# EAGLE schematic glove3 (EAGLE 9.2.0)
COMPANY: ADAFRUIT INDUSTRIES; DRAWN: KTOWN; REV: B
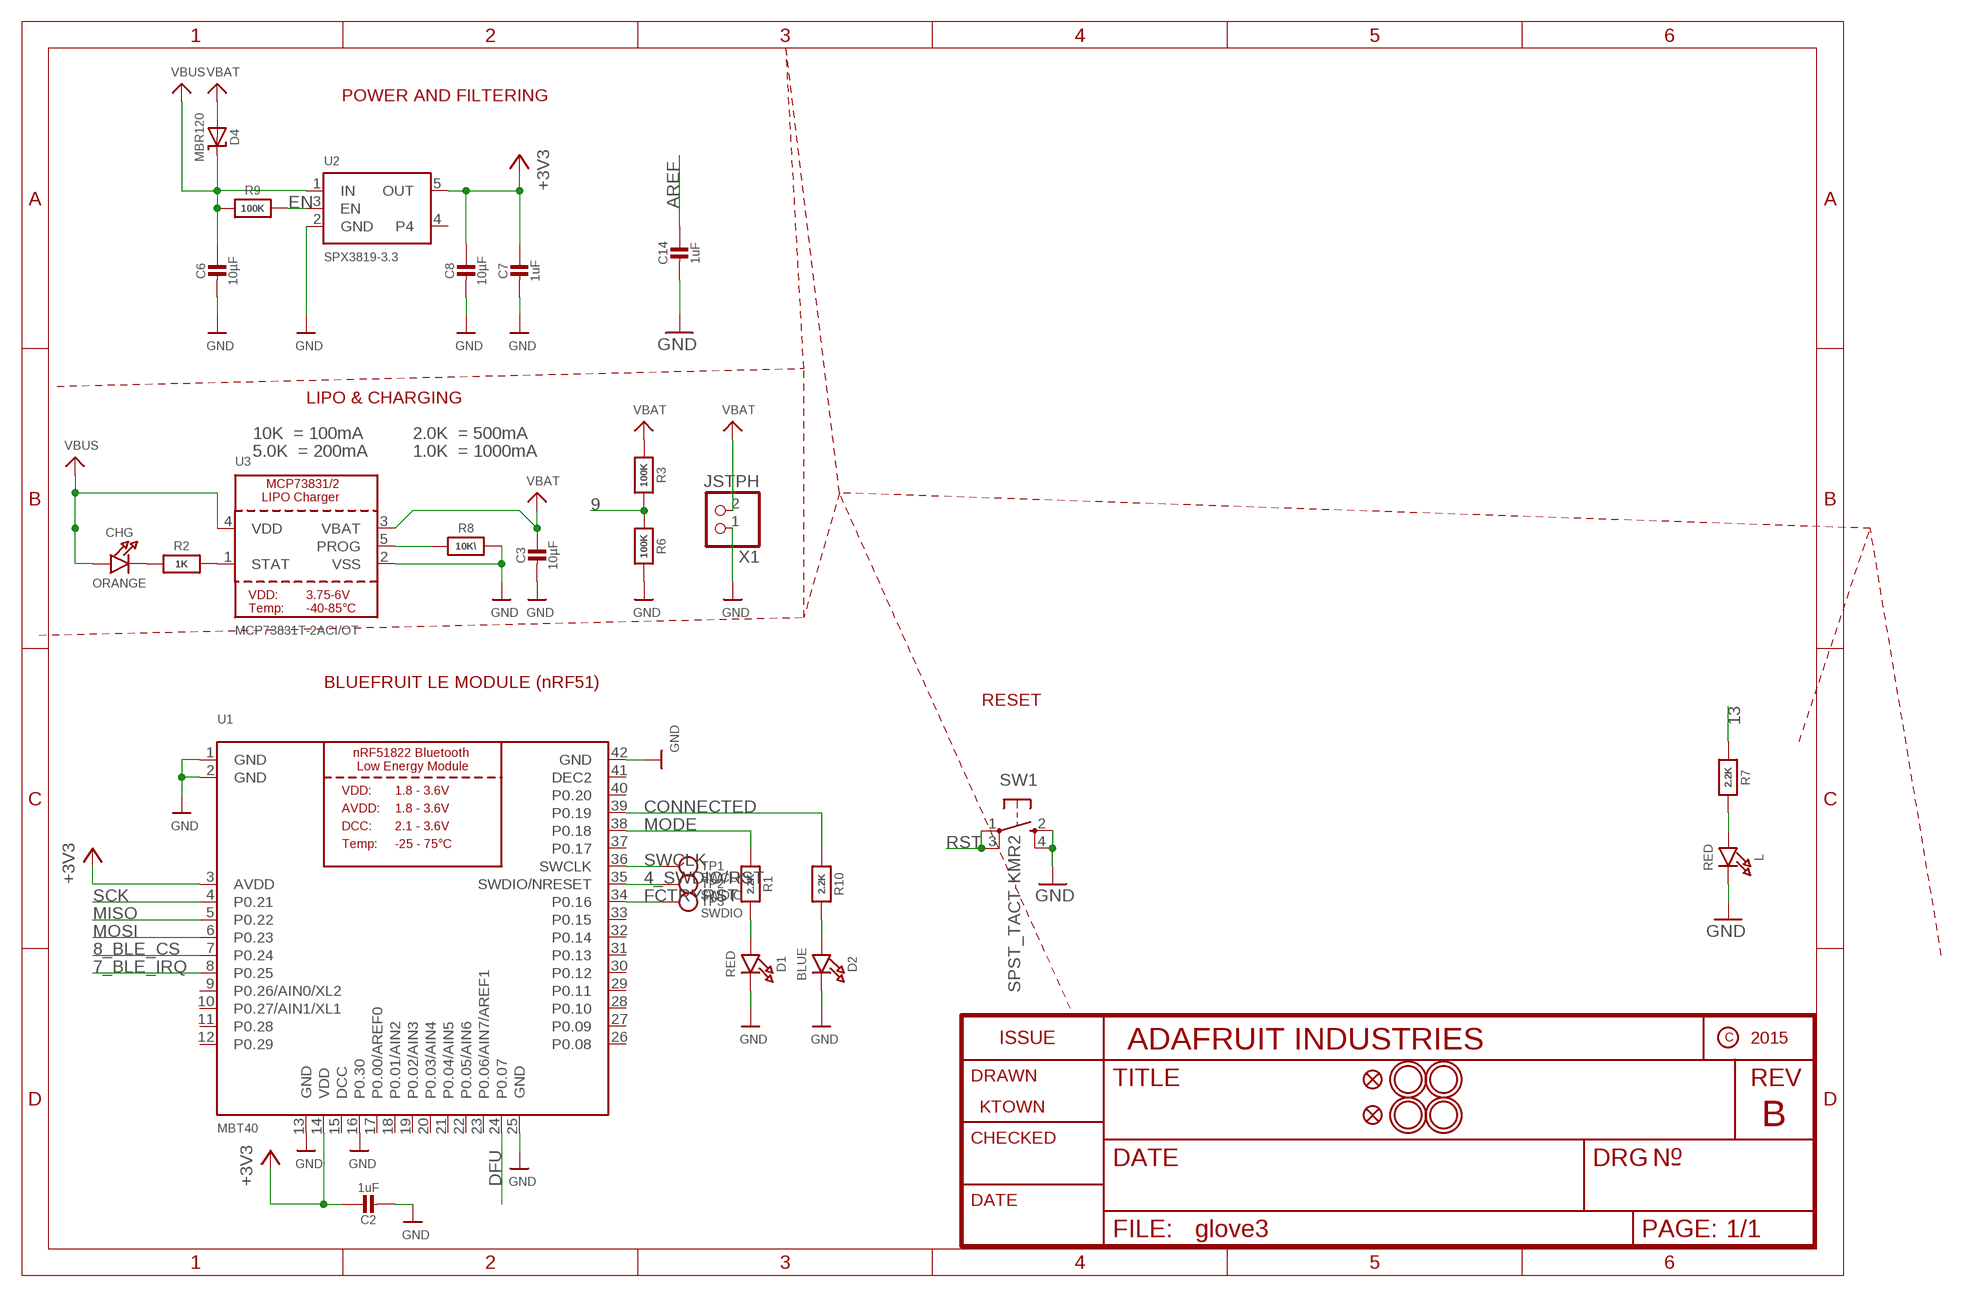
[diagram p0: schematic, sheet 1, part 1 of 2]
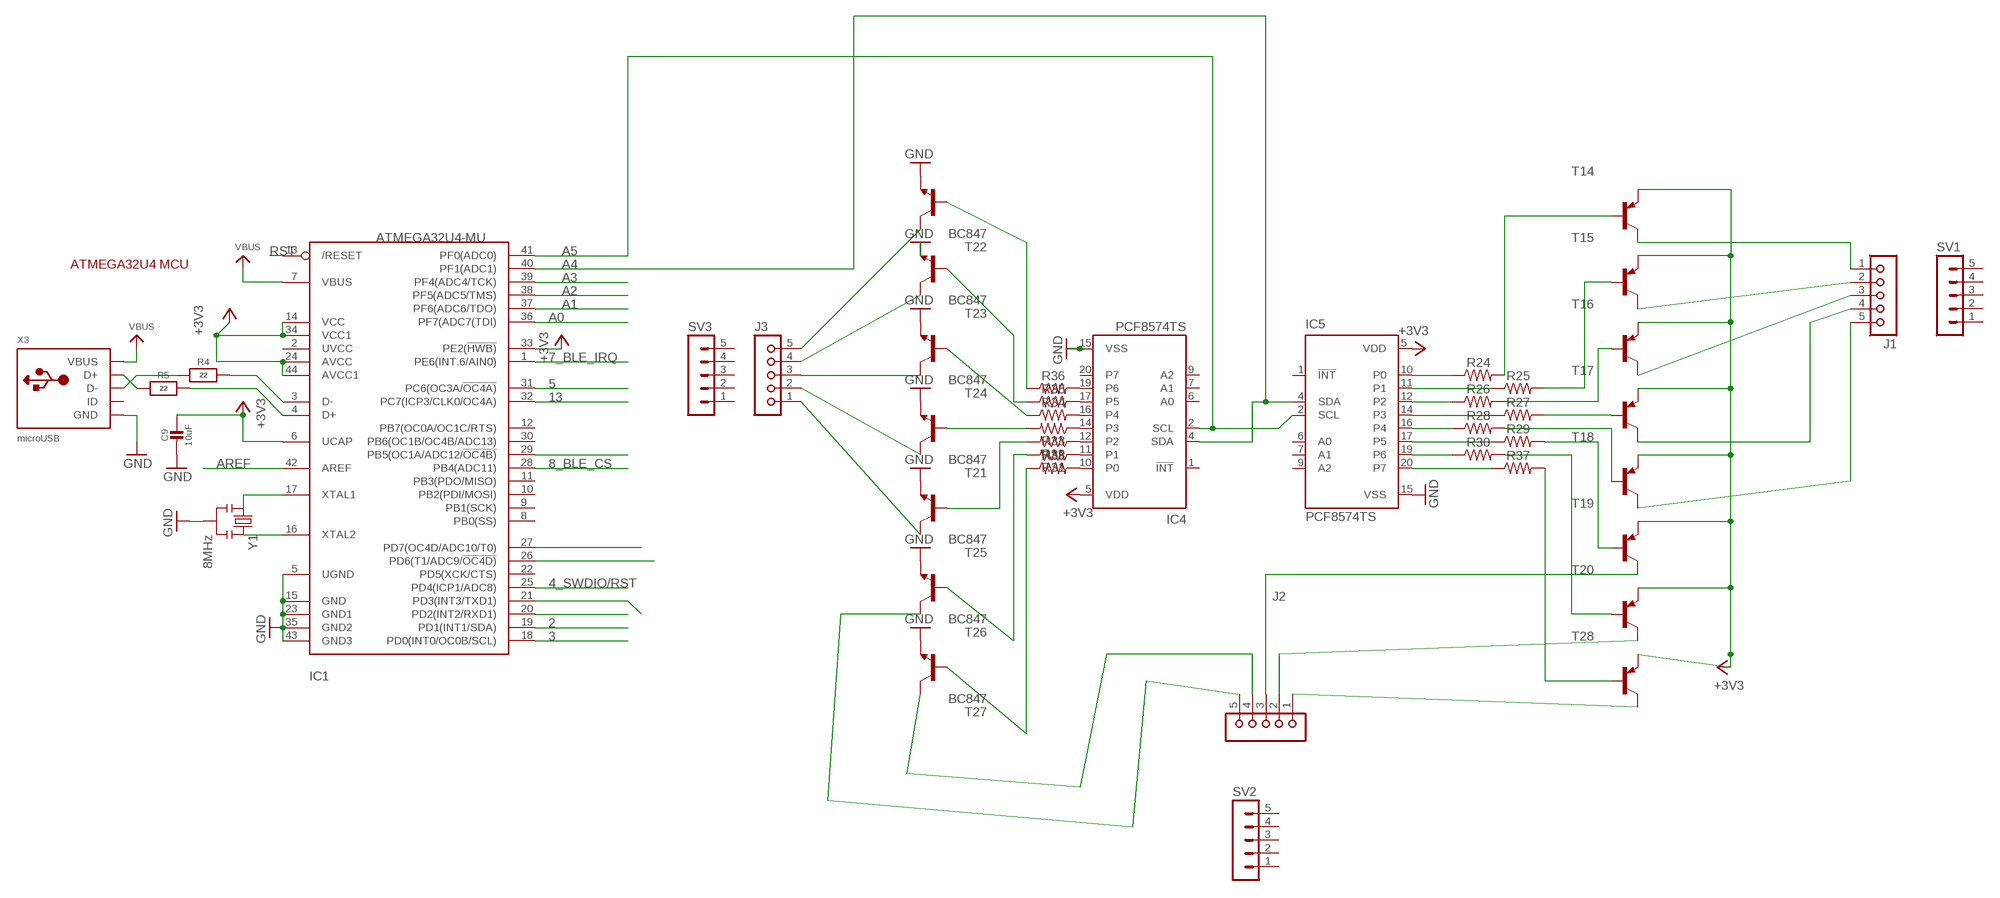
[diagram p1: schematic, sheet 1, part 2 of 2]

## Parts
C2  1uF  CAP_CERAMIC0603_NO  [0603-NO]
C3  10µF  CAP_CERAMIC0805-NOOUTLINE  [0805-NO]
C6  10µF  CAP_CERAMIC0805-NOOUTLINE  [0805-NO]
C7  1uF  CAP_CERAMIC0603_NO  [0603-NO]
C8  10µF  CAP_CERAMIC0805-NOOUTLINE  [0805-NO]
C9  10uF  CAP_CERAMIC_0805MP  [_0805MP]
C14  1uF  CAP_CERAMIC0603_NO  [0603-NO]
CHG  ORANGE  LED0805_NOOUTLINE  [CHIPLED_0805_NOOUTLINE]
D1  RED  LED0805_NOOUTLINE  [CHIPLED_0805_NOOUTLINE]
D2  BLUE  LED0805_NOOUTLINE  [CHIPLED_0805_NOOUTLINE]
D4  MBR120  DIODE-SCHOTTKYSOD-123  [SOD-123]
IC1  ATMEGA32U4-MU  [TQFN44_7MM]
IC4  PCF8574TS  [SSOP20]
IC5  PCF8574TS  [SSOP20]
J1  JU05  [JU05]
J2  JU05  [JU05]
J3  JU05  [JU05]
L  RED  LED0805_NOOUTLINE  [CHIPLED_0805_NOOUTLINE]
R1  2.2K  RESISTOR_0603_NOOUT  [0603-NO]
R2  1K  RESISTOR_0603_NOOUT  [0603-NO]
R3  100K  RESISTOR_0603_NOOUT  [0603-NO]
R4  22  RESISTOR_0603_NOOUT  [0603-NO]
R5  22  RESISTOR_0603_NOOUT  [0603-NO]
R6  100K  RESISTOR_0603_NOOUT  [0603-NO]
R7  2.2K  RESISTOR_0603_NOOUT  [0603-NO]
R8  10K\  RESISTOR_0603_NOOUT  [0603-NO]
R9  100K  RESISTOR_0603_NOOUT  [0603-NO]
R10  2.2K  RESISTOR_0603_NOOUT  [0603-NO]
R24  RESISTOR1206  [1206]
R25  RESISTOR1206  [1206]
R26  RESISTOR1206  [1206]
R27  RESISTOR1206  [1206]
R28  RESISTOR1206  [1206]
R29  RESISTOR1206  [1206]
R30  RESISTOR1206  [1206]
R31  RESISTOR1206  [1206]
R32  RESISTOR1206  [1206]
R33  RESISTOR1206  [1206]
R34  RESISTOR1206  [1206]
R35  RESISTOR1206  [1206]
R36  RESISTOR1206  [1206]
R37  RESISTOR1206  [1206]
R38  RESISTOR1206  [1206]
SV1  MA05-1  [MA05-1]
SV2  MA05-1  [MA05-1]
SV3  MA05-1  [MA05-1]
SW1  SPST_TACT-KMR2  [KMR2]
T14  BC857C-PNP-SOT23-BEC  [SOT23-BEC]
T15  BC857C-PNP-SOT23-BEC  [SOT23-BEC]
T16  BC857C-PNP-SOT23-BEC  [SOT23-BEC]
T17  BC857C-PNP-SOT23-BEC  [SOT23-BEC]
T18  BC857C-PNP-SOT23-BEC  [SOT23-BEC]
T19  BC857C-PNP-SOT23-BEC  [SOT23-BEC]
T20  BC857C-PNP-SOT23-BEC  [SOT23-BEC]
T21  BC847  [SOT23]
T22  BC847  [SOT23]
T23  BC847  [SOT23]
T24  BC847  [SOT23]
T25  BC847  [SOT23]
T26  BC847  [SOT23]
T27  BC847  [SOT23]
T28  BC857C-PNP-SOT23-BEC  [SOT23-BEC]
TP1  SWCLK  TESTPOINT1.5X2.0MM_NOCREAM  [PAD-1.5X2.0]
TP2  SWDIO  TESTPOINT1.5X2.0MM_NOCREAM  [PAD-1.5X2.0]
TP3  SWDIO  TESTPOINT1.5X2.0MM_NOCREAM  [PAD-1.5X2.0]
U1  MBT40  NRF51822_MODULE_MDBT40  [BLE_MODULE_RAYTAC_MDBT40]
U2  SPX3819-3.3  VREG_SOT23-5  [SOT23-5]
U3  MCP73831T-2ACI/OT  MCP73831/2  [SOT23-5]
U$6  MOUNTINGHOLE2.5  [MOUNTINGHOLE_2.5_PLATED]
U$24  MOUNTINGHOLE2.5  [MOUNTINGHOLE_2.5_PLATED]
U$31  MOUNTINGHOLE2.5  [MOUNTINGHOLE_2.5_PLATED]
U$32  MOUNTINGHOLE2.5  [MOUNTINGHOLE_2.5_PLATED]
U$34  FIDUCIAL""  [FIDUCIAL_1MM]
U$35  FIDUCIAL""  [FIDUCIAL_1MM]
X1  JSTPH  CON_JST_PH_2PIN  [JSTPH2]
X3  microUSB  USB_MICRO_20329_V2  [4UCONN_20329_V2]
Y1  8MHz  RESONATORSMD  [RESONATOR-SMD]

## Nets
2: IC1.19(PD1(INT1/SDA))
3: IC1.18(PD0(INT0/OC0B/SCL))
4_SWDIO/RST: IC1.25(PD4(ICP1/ADC8)) TP2.P$1 U1.35(SWDIO/NRESET)
5: IC1.31(PC6(OC3A/!OC4A))
7_BLE_IRQ: IC1.1(PE6(INT.6/AIN0)) U1.8(P0.25)
8_BLE_CS: IC1.28(PB4(ADC11)) U1.7(P0.24)
9: R3.2 R6.1
13: IC1.32(PC7(ICP3/CLK0/OC4A)) R7.1
+3V3: C2.1 C7.1 C8.1 C9.1 IC1.6(UCAP) IC1.14(VCC) IC1.24(AVCC) IC1.33(PE2(!HWB)) IC1.34(VCC1) IC1.44(AVCC1) IC4.5(VDD) IC5.5(VDD) T14.E T15.E T16.E T17.E T18.E T19.E T20.E T28.E U1.3(AVDD) U1.14(VDD) U2.5(OUT)
A0: IC1.36(PF7(ADC7(TDI))
A1: IC1.37(PF6(ADC6/TDO))
A2: IC1.38(PF5(ADC5/TMS))
A3: IC1.39(PF4(ADC4/TCK))
A4: IC1.40(PF1(ADC1)) IC4.4(SDA) IC5.4(SDA)
A5: IC1.41(PF0(ADC0)) IC4.2(SCL) IC5.2(SCL)
AREF: C14.1 IC1.42(AREF)
CONNECTED: R10.1 U1.39(P0.19)
D+: IC1.4(D+) R5.2
D-: IC1.3(D-) R4.2
DFU: U1.24(P0.07)
EN: R9.2 U2.3(EN)
FCTRYRST: TP3.P$1 U1.34(P0.16)
GND: C2.2 C3.2 C6.2 C7.2 C8.2 C9.2 C14.2 D1.C D2.C IC1.5(UGND) IC1.15(GND) IC1.23(GND1) IC1.35(GND2) IC1.43(GND3) IC4.15(VSS) IC5.15(VSS) L.C R6.2 R8.2 SW1.2(S) SW1.4(S1) T21.2(E) T22.2(E) T23.2(E) T24.2(E) T25.2(E) T26.2(E) T27.2(E) U1.1(GND) U1.2(GND) U1.13(GND) U1.16(P0.30) U1.25(GND) U1.42(GND) U2.2(GND) U3.2(VSS) X1.1 X3.BASE@1(GND) X3.BASE@2(GND) X3.GND X3.SPRT@1(GND) X3.SPRT@2(GND) X3.SPRT@3(GND) X3.SPRT@4(GND) Y1.2
MISO: U1.5(P0.22)
MODE: R1.1 U1.38(P0.18)
MOSI: U1.6(P0.23)
N$1: CHG.C R2.1
N$2: L.A R7.2
N$3: R2.2 U3.1(STAT)
N$4: R8.1 U3.5(PROG)
N$5: D1.A R1.2
N$6: D2.A R10.2
N$7: J1.1 T14.C
N$8: J1.2 T15.C
N$9: J1.3 T16.C
N$10: J1.4 T17.C
N$11: IC1.16(XTAL2) Y1.3
N$12: IC1.17(XTAL1) Y1.1
N$13: J1.5 T18.C
N$14: J3.5 T22.3(C)
N$15: R5.1 X3.D+
N$16: R4.1 X3.D-
N$17: IC1.20(PD2(INT2/RXD1))
N$18: IC1.21(PD3(INT3/TXD1))
N$19: J3.4 T23.3(C)
N$20: IC1.26(PD6(T1/ADC9/!OC4D))
N$21: IC1.27(PD7(OC4D/ADC10/T0))
N$22: IC1.29(PB5(OC1A/ADC12/!OC4B))
N$23: J3.3 T24.3(C)
N$24: J3.2 T21.3(C)
N$25: J3.1 T25.3(C)
N$26: J2.5 T26.3(C)
N$27: J2.4 T27.3(C)
N$28: J2.2 T20.C
N$29: J2.3 T19.C
N$30: J2.1 T28.C
N$38: IC5.10(P0) R24.1
N$39: IC5.11(P1) R25.1
N$46: IC5.12(P2) R26.1
N$48: IC5.14(P3) R27.1
N$49: IC5.16(P4) R28.1
N$50: IC5.17(P5) R29.1
N$51: IC5.19(P6) R30.1
N$52: R24.2 T14.B
N$53: R25.2 T15.B
N$54: R26.2 T16.B
N$55: R27.2 T17.B
N$56: R28.2 T18.B
N$57: R29.2 T19.B
N$58: R30.2 T20.B
N$59: IC4.10(P0) R38.2
N$60: R36.1 T22.1(B)
N$61: R35.1 T23.1(B)
N$62: R34.1 T24.1(B)
N$63: R33.2 T21.1(B)
N$64: R32.2 T25.1(B)
N$65: R31.2 T26.1(B)
N$66: IC4.11(P1) R31.1
N$67: IC4.12(P2) R32.1
N$68: IC4.14(P3) R33.1
N$69: IC4.16(P4) R34.2
N$70: IC4.17(P5) R35.2
N$71: IC4.19(P6) R36.2
N$72: IC5.20(P7) R37.1
N$73: R38.1 T27.1(B)
N$74: R37.2 T28.B
RST: IC1.13(/RESET) SW1.1(P) SW1.3(P1)
SCK: U1.4(P0.21)
SWCLK: TP1.P$1 U1.36(SWCLK)
VBAT: C3.1 D4.A R3.1 U3.3(VBAT) X1.2
VBUS: C6.1 CHG.A D4.C IC1.7(VBUS) R9.1 U2.1(IN) U3.4(VDD) X3.VBUS
Unconnected: IC1.2(UVCC) IC1.8(PB0(SS)) IC1.9(PB1(SCK)) IC1.10(PB2(PDI/MOSI)) IC1.11(PB3(PDO/MISO)) IC1.12(PB7(OC0A/OC1C/RTS)) IC1.22(PD5(XCK/CTS)) IC1.30(PB6(OC1B/OC4B/ADC13)) IC4.1(!INT) IC4.6(A0) IC4.7(A1) IC4.9(A2) IC4.20(P7) IC5.1(!INT) IC5.6(A0) IC5.7(A1) IC5.9(A2) SV1.1 SV1.2 SV1.3 SV1.4 SV1.5 SV2.1 SV2.2 SV2.3 SV2.4 SV2.5 SV3.1 SV3.2 SV3.3 SV3.4 SV3.5 U1.9(P0.26/AIN0/XL2) U1.10(P0.27/AIN1/XL1) U1.11(P0.28) U1.12(P0.29) U1.17(P0.00/AREF0) U1.18(P0.01/AIN2) U1.19(P0.02/AIN3) U1.20(P0.03/AIN4) U1.21(P0.04/AIN5) U1.22(P0.05/AIN6) U1.23(P0.06/AIN7/AREF1) U1.26(P0.08) U1.27(P0.09) U1.28(P0.10) U1.29(P0.11) U1.30(P0.12) U1.31(P0.13) U1.32(P0.14) U1.33(P0.15) U1.37(P0.17) U1.40(P0.20) U2.4 X3.ID

## Notes on the sheet
- ATMEGA32U4 MCU
- POWER AND FILTERING
- LIPO & CHARGING
- 10K  = 100mA | 2.0K  = 500mA
- 5.0K  = 200mA | 1.0K  = 1000mA
- BLUEFRUIT LE MODULE (nRF51)
- RESET

## Power pins joined to a net without a drawn wire
DCC: U1.15(DCC)
DEC2: U1.41(DEC2)

## Library data of the parts
C2 C3 C6-C9 C14 = microbuilder:CAP_CERAMIC: Ceramic Capacitors For new designs, use the packages preceded by an '_' character since they are more reliable: The following footprints should be used on most boards: _0402 - Standard footprint for regular board layouts _0603 - Standard footprint for regular board layouts _0805 - Standard footprint for regular board layouts _1206 - Standard footprint for regular board layouts For extremely tight-pitch boards where space is at a premium, the following 'micro-pitch' footprints can be used (smaller pads, no silkscreen outline, etc.): _0402MP - Micro-pitch footprint for very dense/compact boards _0603MP - Micro-pitch footprint for very dense/compact boards _0805MP - Micro-pitch footprint for very dense/compact boards _1206MP - Micro-pitch footprint for very dense/compact boards
CHG D1 D2 L = microbuilder:LED: LED 0603 - 0603 Surface Mount Package 2mA: Green LED - Low Power (3.9mcd, 2ma, 1.7Vf) - Digikey: 475-2709-2-ND Orange LED - Low Power (9.8mcd, 2ma, 1.8Vf) - Digikey: 475-1194-2-ND Red LED - Low Power (5mcd, 2ma, 1.8Vf) - Digikey: 475-1195-2-ND Yellow LED - Low Power (7mcd, 2ma, 1.8Vf) - Digikey: 475-1196-2-ND 5mA: Blue LED - Low Power (17mcd, 5ma, 2.9Vf) - Digikey: LNJ937W8CRACT-ND 0805 - 0805 Surface Mount Package 2mA: Red LED (8.8mcd, 2mA, 1.8Vf, Clear) - Low Power [Digikey: 475-2510-1-ND] Green LED (5mcd, 2mA, 1.8Vf, Clear) - Low Power [Digikey: 475-2730-1-ND] Yellow LED (11.3mcd, 2mA, 1.8Vf, Clear) - Low Power [Digikey: 475-2555-1-ND] 20mA: Red LED (104mcd, 20mA, Diffused) - LS R976 [Digikey: 475-1278-6-ND] Red LED (12mcd, 20mA, 2.0Vf, Clear) - APT2012EC [Digikey: 754-1128-1-ND] Green LED (15mcd, 20mA, 2.2Vf, Clear) - APT2012GC [Digikey: 754-1131-1-ND] Orange LED (160mcd, 20mA, 2.1Vf, Clear) - APT2012SECK [Digikey: 754-1130-1-ND] 1206 - 1206 Surface Mount Package Green LED (26mcd, 20mA, Diffused) - LG N971 [Digikey: 475-1407-6-ND] Red LED (15mcd, 20mA, Diffused) - LH N974 [Digikey: 475-1416-6-ND] Cree - Cree High-Power Surface Mount LEDs XPEBWT-L1-0000-00D50 - White 111lm 350mA 2.9Vf 6200K 110° XTEAWT-00-0000-00000LEE3 - White 114lm 350mA 2.85Vf 5000K 115° Everlight - Everlight 45-21 Series Surface Mount LEDs 45-21/QK2C-B2832AC2CB2/2T - Warm White 2000mcd 20mA 3.25Vf 3050K 120° 45-21/LK2C-B38452C4CB2/2T - Nuetral White 2000mcd 20mA 3.25Vf 4150K 120° 45-21/LK2C-B50634C6CB2/2T - Cold White 2200mcd 20mA 3.25Vf 5650K 120° PLCC2 Reverse Mount LS T77K-J1L2-1-0-2-R18-Z - Red 11.25mcd 2mA 1.8Vf 630nm 120° LO T77K-L1M2-24-Z - Orange 19.6mcd 2mA 1.8Vf 606nm 120° LY T77K-K2M1-26-Z - Yellow 15.7mcd 2mA 1.8Vf 587nm 120°
D4 = microbuilder:DIODE-SCHOTTKY
IC1 = microbuilder:ATMEGA32U4: http://www.ladyada.net/library/eagle
IC4 IC5 = micro-philips:PCF8574: I2C-Bus Remote 8-bit I/O expander http://www.semiconductors.philips.com/acrobat_download/datasheets/PCF8574_4.pdf; MPN: PCF8574TS/3,118; OC_FARNELL: 1506644; OC_NEWARK: 70R6873
J1-J3 = con-lsta:JU05: PIN HEADER; OC_FARNELL: unknown; OC_NEWARK: unknown
R1-R10 = microbuilder:RESISTOR: Resistors For new designs, use the packages preceded by an '_' character since they are more reliable: The following footprints should be used on most boards: _0402 - Standard footprint for regular board layouts _0603 - Standard footprint for regular board layouts _0805 - Standard footprint for regular board layouts _1206 - Standard footprint for regular board layouts For extremely tight-pitch boards where space is at a premium, the following 'micro-pitch' footprints can be used (smaller pads, no silkscreen outline, etc.): _0402MP - Micro-pitch footprint for very dense/compact boards _0603MP - Micro-pitch footprint for very dense/compact boards _0805MP - Micro-pitch footprint for very dense/compact boards _1206MP - Micro-pitch footprint for very dense/compact boards
R24-R38 = SparkFun-Resistors:RESISTOR: Generic Resistor Package
SV1-SV3 = con-lstb:MA05-1: PIN HEADER; OC_FARNELL: unknown; OC_NEWARK: unknown
SW1 = adafruit:SPST_TACT: SMT 6mm switch, EVQQ2 series http://www.ladyada.net/library/eagle
T14-T20 T28 = transistor:*-PNP-: PNP Transistror
T21-T27 = transistor:BC847: NPN TRANSISTOR
TP1-TP3 = microbuilder:TESTPOINT: Test Point Various test points for characterisation and PCB testing TESTPOINT_SMT - Compact Surface Mount Test Point [Digikey: 5016KTR-ND]
U1 = microbuilder:NRF51822_MODULE_MDBT40: nRF51822 Bluetooth Low Energy Module
U2 = microbuilder:VREG_SOT23-5: SOT23-5 Fixed Voltage Regulators Part Current Out V Out V In V Dropout θJA (°C/W) TJ (°C) Digikey Part No. ADP121 150mA 3.3V 3.4-5.5V 0.09V @ 150mA -- -- ADP121-AUJZ33R7CT-ND ADP121 150mA 3.0V 3.1-5.5V 0.09V @ 150mA -- -- ADP121-AUJZ30R7CT-ND ADP122 300mA 3.3V 3.4-5.5V 0.085V @ 300mA -- -- ADP122AUJZ-3.3-R7CT-ND ADP1712 300mA 3.3V 3.5-5.5V 0.17V @ 300mA -- -- ADP1712AUJZ-3.3-R7TR-ND AP7311 (Low Cost) 150mA 3.3V 3.5-6V 0.15V @ 150mA -- -- AP7311-33WG-7DICT-ND LD39015M18R 150mA 1.8V 1.9V-5.5V 0.08V @ 100mA -- -- 497-6977-1-ND LP2985A-33DBVR 150mA 3.3V 3.3-16V 0.28V @ 150mA 206 150 296-18479-1-ND MCP1824T-3302E/OT 300mA 3.3V 3.5V-6V 0.2V @ 300mA -- -- MCP1824T-3302E/OTCT-ND MIC5205-2.5YM5 TR 150mA 2.5V 2.7-16V 0.165V @ 150mA -- -- 576-1257-2-ND MIC5205-3.0YM5 TR 150mA 3.0V 3.2V-16V 0.165V @ 150mA -- -- 576-1258-2-ND MIC5205-3.3YM5 TR 150mA 3.3V 3.5V-16V 0.165V @ 150mA -- -- 576-1259-2-ND TPS780330220 150mA 3.3V+2.2V 3.6-5.5V 250mV Max -- -- 296-23332-1-ND TDA3663/N1,135 100mA 3.3V 3.5-45V 0.18V @ 50mA -- -- 568-5343-1-ND Max operating temp can be calculated using θJA, TJ (max junction temperature), and power in watts. Set the "Maximum Ambient Temperature" until it reaches TJ ("Max Junction Temperature"), which is the absolute limit for safe use of the regulator: Heat Sink Temperature Calculator <http://www.daycounter.com/Calculators/Heat-Sink-Temperature-Calculator.phtml> For example, With 12V source into a 3.3V LP2985 and a 30mA load, we are dissipating (12V-3.3V) * 0.03A = 0.261W. With a θJA of 206 °C/W, a TJ of 150°C, and 261mW we can safely use the chip without a heat sink up to 75°C (=147.1°C Junction Temperature).
U3 = microbuilder:MCP73831/2: MCP73831/2 LIPO Charger VDD: 3.75 - 6V Temp -40 - 85°C Programmable Charge Rate: 15-500mA NOTE: STAT is a tri-state logic output on the MCP73831 and an open-drain output on the MCP73832. SOT23-5 with 4.2V output and tri-state logic on STAT = MCP73831T-2ACI/OT
U$6 U$24 U$31 U$32 = microbuilder:MOUNTINGHOLE: Mounting Hole For #2 screws (0.086"/2.18mm width, 0.094"/2.4mm hole) use 2.5mm; BOM: EXCLUDE
U$34 U$35 = microbuilder:FIDUCIAL: Fiducial Alignment Points Various fiducial points for machine vision alignment.; BOM: EXCLUDE
X1 = microbuilder:CON_JST_PH_2PIN: JST 2-Pin Right-Angle Connector PH-Series - 4UConnector: 17311 SH-Series - 4UConnector: 07278
X3 = microbuilder:USB: USB Connectors USBMINIB - Surface Mount Female Mini-B USB Connector 4UConnector: 06564
Y1 = SparkFun:RESONATOR: Resonator Small SMD resonator. This is the itty bitty 10/20MHz resonators with built in caps. CSTCE10M0G55 and CSTCE20M0V53. Footprint has been reviewed closely but hasn't been tested yet.

## Module T
Ports: 

### Library data of the parts